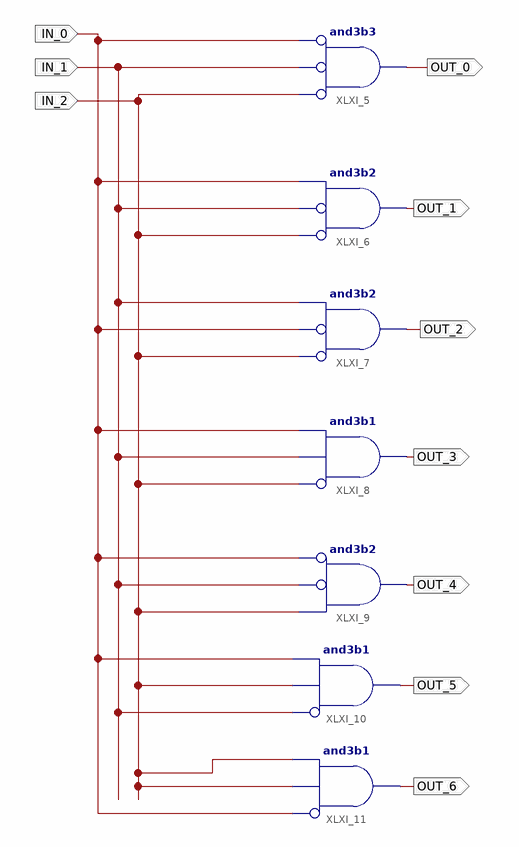
[diagram p0: schematic sheet 1]
// Xilinx ISE schematic myDecoder3to7.sch (spartan3a) as structural Verilog: 7 symbols, 10 ports
module myDecoder3to7 (
  input  IN_0,
  input  IN_1,
  input  IN_2,
  output OUT_0,
  output OUT_1,
  output OUT_2,
  output OUT_3,
  output OUT_4,
  output OUT_5,
  output OUT_6
);

  and XLXI_5 (OUT_0, ~IN_2, ~IN_1, ~IN_0);  // and3b3
  and XLXI_6 (OUT_1, ~IN_2, ~IN_1, IN_0);  // and3b2
  and XLXI_7 (OUT_2, ~IN_2, ~IN_0, IN_1);  // and3b2
  and XLXI_8 (OUT_3, ~IN_2, IN_1, IN_0);  // and3b1
  and XLXI_9 (OUT_4, ~IN_0, ~IN_1, IN_2);  // and3b2
  and XLXI_10 (OUT_5, ~IN_1, IN_2, IN_0);  // and3b1
  and XLXI_11 (OUT_6, ~IN_0, IN_2, IN_2);  // and3b1
endmodule
